# Altium project EpicCubeDiagram.PrjPCB
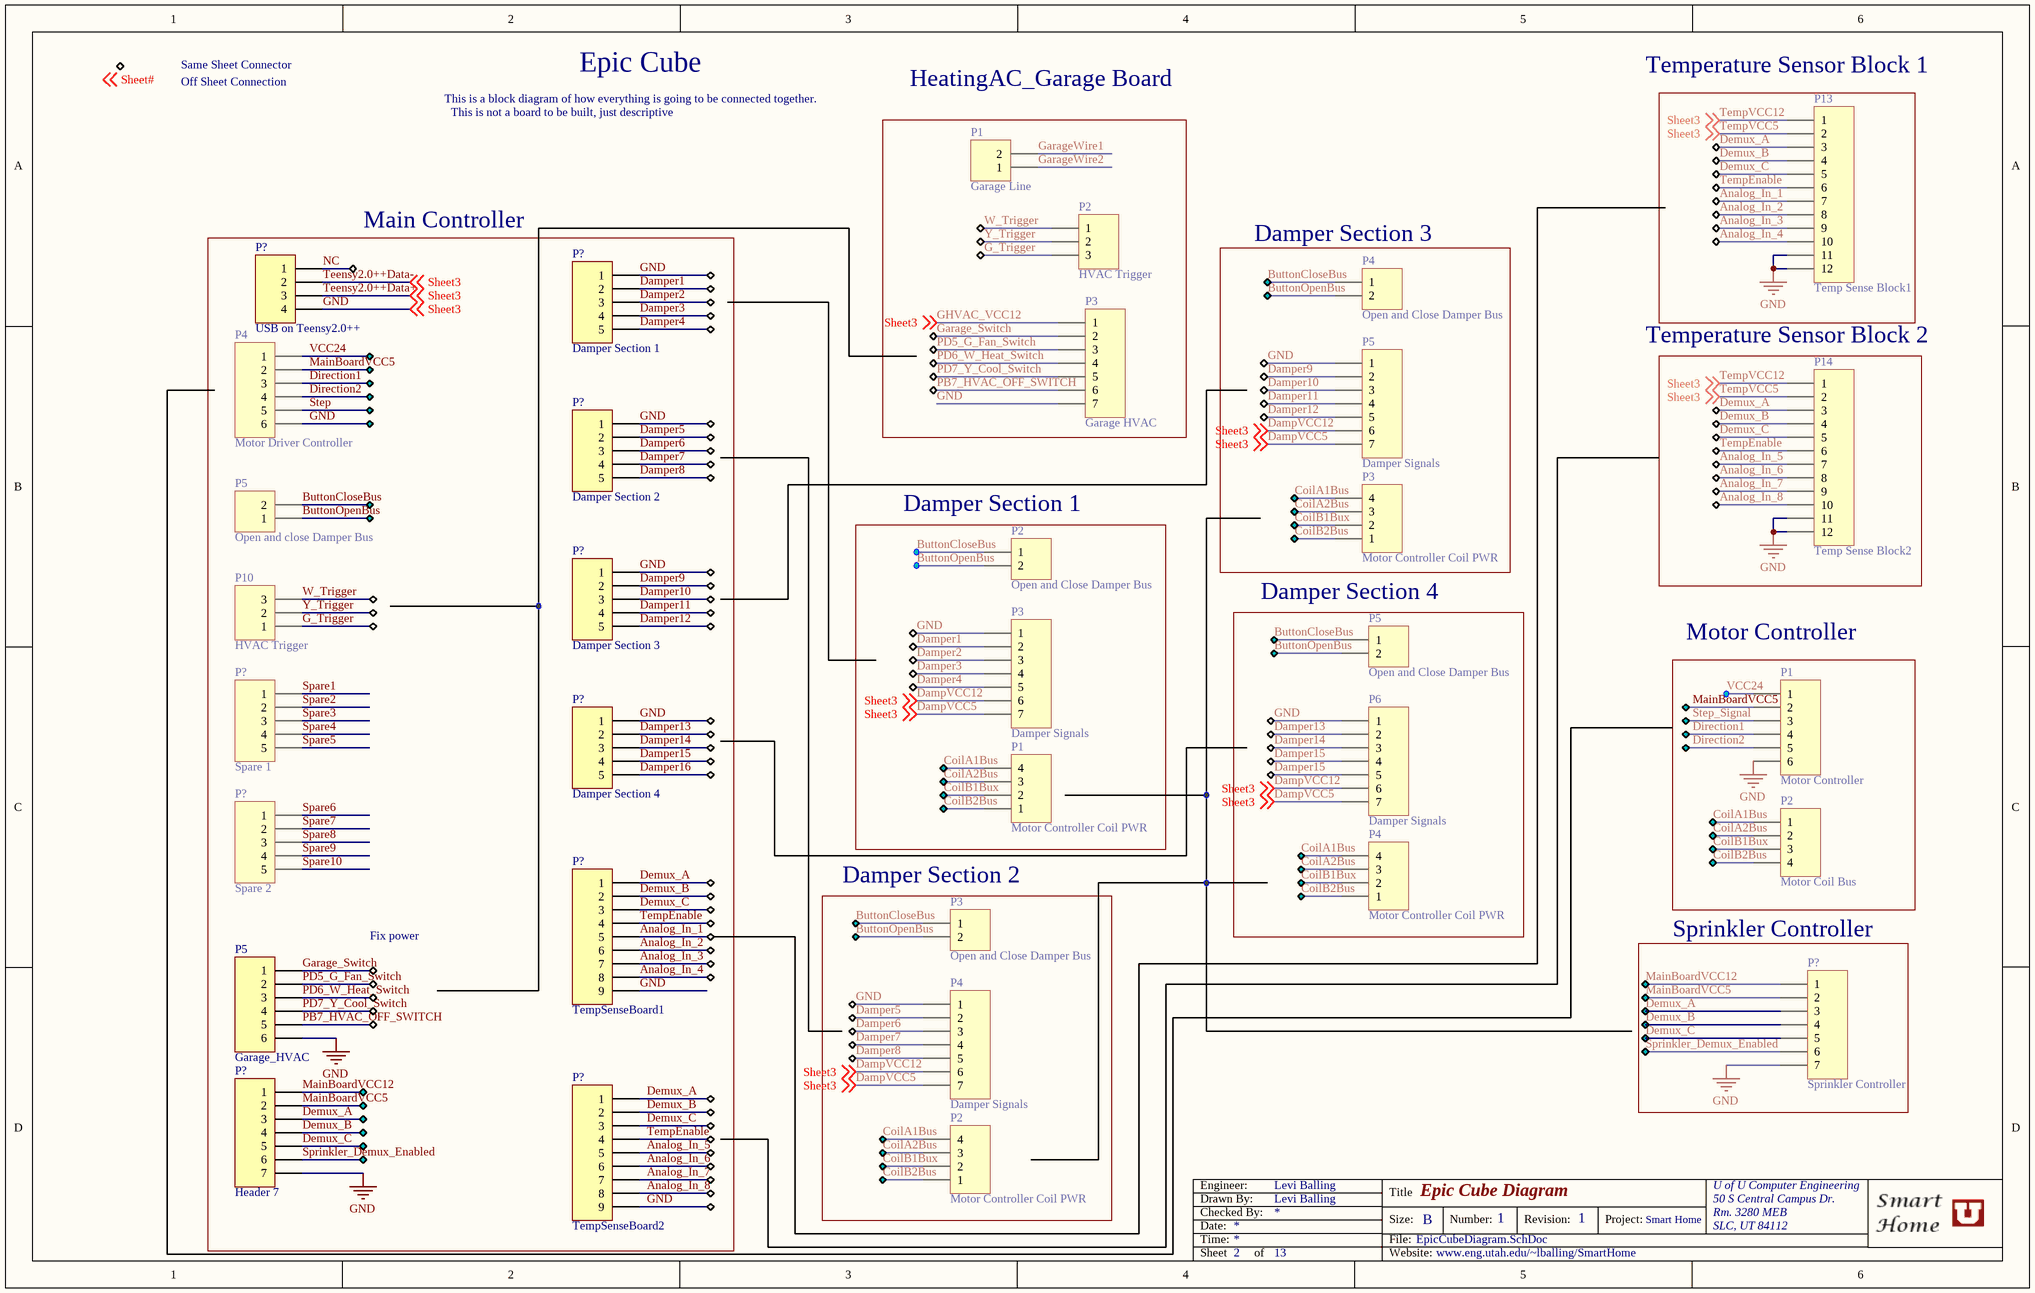
[diagram p0: EpicCubeDiagram.SchDoc]
3 sheets, 72 parts. Net scope: global (net labels, ports and power ports of the same name join across sheets).
Sheets:
  EpicCubeDiagram.SchDoc
  EpicCubeDiagram2.SchDoc
  TheEpicCube.SchDoc

## Sheet EpicCubeDiagram.SchDoc: Epic Cube Diagram
size B; CompanyName: Smart Home; DrawnBy: Levi Balling; Engineer: Levi Balling; Organization: U of U Computer Engineering; Address1: 50 S Central Campus Dr.; Address2: Rm. 3280 MEB; Address3: SLC, UT 84112; DocumentNumber: 1; Revision: 1; SheetNumber: 2; SheetTotal: 13; Project: Smart Home; Website: www.eng.utah.edu/~lballing/SmartHome

### Parts
(Parts that share a designator on the sheet are numbered #1, #2 ... from top to bottom, then left to right.)
P1#1  Garage Line  [HDR1X2]
P1#2  Motor Controller  [HDR1X6]
P1#3  Motor Controller Coil PWR  [HDR1X4]
P2#1  HVAC Trigger  [HDR1X3]
P2#2  Open and Close Damper Bus  [HDR1X2]
P2#3  Motor Coil Bus  [HDR1X4]
P2#4  Motor Controller Coil PWR  [HDR1X4]
P3#1  Garage HVAC  [HDR1X7]
P3#2  Motor Controller Coil PWR  [HDR1X4]
P3#3  Damper Signals  [HDR1X7]
P3#4  Open and Close Damper Bus  [HDR1X2]
P4#1  Open and Close Damper Bus  [HDR1X2]
P4#2  Motor Driver Controller  [HDR1X6]
P4#3  Motor Controller Coil PWR  [HDR1X4]
P4#4  Damper Signals  [HDR1X7]
P5#1  Damper Signals  [HDR1X7]
P5#2  Open and close Damper Bus  [HDR1X2]
P5#3  Open and Close Damper Bus  [HDR1X2]
P5#4  Garage_HVAC  [HDR1X6]
P6#1  Damper Signals  [HDR1X7]
P10  HVAC Trigger  [HDR1X3]
P13  Temp Sense Block1  [HDR1X12]
P14  Temp Sense Block2  [HDR1X12]
P?#1  USB on Teensy2.0++  [HDR1X4]
P?#2  Damper Section 1  [HDR1X5]
P?#3  Damper Section 2  [HDR1X5]
P?#4  Damper Section 3  [HDR1X5]
P?#5  Spare 1  [HDR1X5]
P?#6  Damper Section 4  [HDR1X5]
P?#7  Spare 2  [HDR1X5]
P?#8  TempSenseBoard1  [HDR1X9]
P?#9  Sprinkler Controller  [HDR1X7]
P?#10  Header 7  [HDR1X7]
P?#11  TempSenseBoard2  [HDR1X9]

### Blocks framed on the sheet
Main Controller: P4#2 P5#2 P5#4 P10 P?#1-P?#8 P?#10 P?#11
Damper Section 3: P3#2 P4#1 P5#1
Damper Section 1: P1#3 P2#2 P3#3
Damper Section 4: P4#3 P5#3 P6#1
Motor Controller: P1#2 P2#3
Damper Section 2: P2#4 P3#4 P4#4
Sprinkler Controller: P?#9

### Nets
DampVCC12: P1#2.6 P3#1.1 P3#1.7 P3#3.1 P3#3.6 P3#3.7 P4#2.6 P4#4.1 P4#4.6 P4#4.7 P5#1.1 P5#1.6 P5#1.7 P5#4.6 P6#1.1 P6#1.6 P6#1.7 P13.1 P13.2 P13.11 P13.12 P14.1 P14.2 P14.11 P14.12 P?#1.2 P?#1.3 P?#1.4 P?#2.1 P?#3.1 P?#4.1 P?#6.1 P?#8.9 P?#9.7 P?#10.7 P?#11.9 ; off-sheet Sheet3  [also labelled DampVCC5, GHVAC_VCC12, GND, Sheet3, Teensy2.0++Data+, Teensy2.0++Data-, TempVCC12, TempVCC5]
Analog_In_1: P13.7 P?#8.5
Analog_In_2: P13.8 P?#8.6
Analog_In_3: P13.9 P?#8.7
Analog_In_4: P13.10 P?#8.8
Analog_In_5: P14.7 P?#11.5
Analog_In_6: P14.8 P?#11.6
Analog_In_7: P14.9 P?#11.7
Analog_In_8: P14.10 P?#11.8
ButtonCloseBus: P2#2.1 P3#4.1 P4#1.1 P5#2.2 P5#3.1
ButtonOpenBus: P2#2.2 P3#4.2 P4#1.2 P5#2.1 P5#3.2
CoilA1Bus: P1#3.4 P2#3.1 P2#4.4 P3#2.4 P4#3.4
CoilA2Bus: P1#3.3 P2#3.2 P2#4.3 P3#2.3 P4#3.3
CoilB1Bux: P1#3.2 P2#3.3 P2#4.2 P3#2.2 P4#3.2
CoilB2Bus: P1#3.1 P2#3.4 P2#4.1 P3#2.1 P4#3.1
Damper1: P3#3.2 P?#2.2
Damper2: P3#3.3 P?#2.3
Damper3: P3#3.4 P?#2.4
Damper4: P3#3.5 P?#2.5
Damper5: P4#4.2 P?#3.2
Damper6: P4#4.3 P?#3.3
Damper7: P4#4.4 P?#3.4
Damper8: P4#4.5 P?#3.5
Damper9: P5#1.2 P?#4.2
Damper10: P5#1.3 P?#4.3
Damper11: P5#1.4 P?#4.4
Damper12: P5#1.5 P?#4.5
Damper13: P6#1.2 P?#6.2
Damper14: P6#1.3 P?#6.3
Damper15: P6#1.4 P6#1.5 P?#6.4
Damper16: P?#6.5
Demux_A: P13.3 P14.3 P?#8.1 P?#9.3 P?#10.3 P?#11.1
Demux_B: P13.4 P14.4 P?#8.2 P?#9.4 P?#10.4 P?#11.2
Demux_C: P13.5 P14.5 P?#8.3 P?#9.5 P?#10.5 P?#11.3
Direction1: P1#2.4 P4#2.3
Direction2: P1#2.5 P4#2.4
G_Trigger: P2#1.3 P10.1
Garage_Switch: P3#1.2 P5#4.1
GarageWire1: P1#1.2
GarageWire2: P1#1.1
MainBoardVCC5: P1#2.2 P4#2.2 P?#9.2 P?#10.2
MainBoardVCC12: P?#9.1 P?#10.1
NC: P?#1.1
PB7_HVAC_OFF_SWITCH: P3#1.6 P5#4.5
PD5_G_Fan_Switch: P3#1.3 P5#4.2
PD6_W_Heat_Switch: P3#1.4 P5#4.3
PD7_Y_Cool_Switch: P3#1.5 P5#4.4
Spare1: P?#5.1
Spare2: P?#5.2
Spare3: P?#5.3
Spare4: P?#5.4
Spare5: P?#5.5
Spare6: P?#7.1
Spare7: P?#7.2
Spare8: P?#7.3
Spare9: P?#7.4
Spare10: P?#7.5
Sprinkler_Demux_Enabled: P?#9.6 P?#10.6
Step: P4#2.5
Step_Signal: P1#2.3
TempEnable: P13.6 P14.6 P?#8.4 P?#11.4
VCC24: P1#2.1 P4#2.1
W_Trigger: P2#1.1 P10.3
Y_Trigger: P2#1.2 P10.2

### Notes on the sheet
- Same Sheet Connector
- Off Sheet Connection
- This is a block diagram of how everything is going to be connected together.
- Epic Cube
- HeatingAC_Garage Board
- (near P13) Temperature Sensor Block 1
- This is not a board to be built, just descriptive
- Temperature Sensor Block 2
- Fix power
- Labels drawn without touching a wire or pin: Sheet#
- Date:
- Time:
- Engineer:
- Drawn By:
- Checked By:
- Title
- Size:
- File:
- B
- Number:
- Revision:
- Project:
- Sheet
- of
- Website:

### Library data of the parts
P1#1 P2#2 P3#4 P4#1 P5#2 P5#3 = Header 2: Header, 2-Pin; Vendor: Taydaelectronics; LatestRevisionDate: 17-Jul-2002; LatestRevisionNote: Re-released for DXP Platform.; Publisher: Altium Limited; Price: 0.02; Value: Header 2
P1#2 P4#2 P5#4 = Header 6: Header, 6-Pin; Vendor: Taydaelectronics; LatestRevisionDate: 17-Jul-2002; LatestRevisionNote: Re-released for DXP Platform.; Publisher: Altium Limited; Price: 0.06; Value: Header 6
P1#3 P2#3 P2#4 P3#2 P4#3 P?#1 = Header 4: Header, 4-Pin; Vendor: Taydaelectronics; LatestRevisionDate: 17-Jul-2002; LatestRevisionNote: Re-released for DXP Platform.; Publisher: Altium Limited; Price: 0.04; Value: Header 4
P2#1 = Header 3: Header, 3-Pin; Vendor: Taydaelectronics; LatestRevisionDate: 17-Jul-2002; LatestRevisionNote: Re-released for DXP Platform.; Publisher: Altium Limited; Price: 0.03; Value: Header 3
P3#1 P3#3 P4#4 P5#1 P6#1 P?#9 P?#10 = Header 7: Header, 7-Pin; Vendor: Taydaelectronics; LatestRevisionDate: 17-Jul-2002; LatestRevisionNote: Re-released for DXP Platform.; Publisher: Altium Limited; Price: 0.07; Value: Header 7
P10 = Header 3: Header, 3-Pin; Vendor: Taydaelectronics; Value: Header 2; LatestRevisionDate: 17-Jul-2002; LatestRevisionNote: Re-released for DXP Platform.; Publisher: Altium Limited; Price: 0.03
P13 P14 = Header 12: Header, 12-Pin; Vendor: Taydaelectronics; LatestRevisionDate: 17-Jul-2002; LatestRevisionNote: Re-released for DXP Platform.; Publisher: Altium Limited; Price: 0.12; Value: Header 12
P?#2-P?#7 = Header 5: Header, 5-Pin; Vendor: Taydaelectronics; LatestRevisionDate: 17-Jul-2002; LatestRevisionNote: Re-released for DXP Platform.; Publisher: Altium Limited; Price: 0.05; Value: Header 5
P?#8 P?#11 = Header 9: Header, 9-Pin; Vendor: Taydaelectronics; LatestRevisionDate: 17-Jul-2002; LatestRevisionNote: Re-released for DXP Platform.; Publisher: Altium Limited; Price: 0.09; Value: Header 9

## Sheet EpicCubeDiagram2.SchDoc: Epic Cube Diagram
size B; CompanyName: Smart Home; DrawnBy: Levi Balling; Engineer: Levi Balling; Organization: U of U Computer Engineering; Address1: 50 S Central Campus Dr.; Address2: Rm. 3280 MEB; Address3: SLC, UT 84112; DocumentNumber: 1; Revision: 1; SheetNumber: 3; SheetTotal: 13; Project: Smart Home; Website: www.eng.utah.edu/~lballing/SmartHome
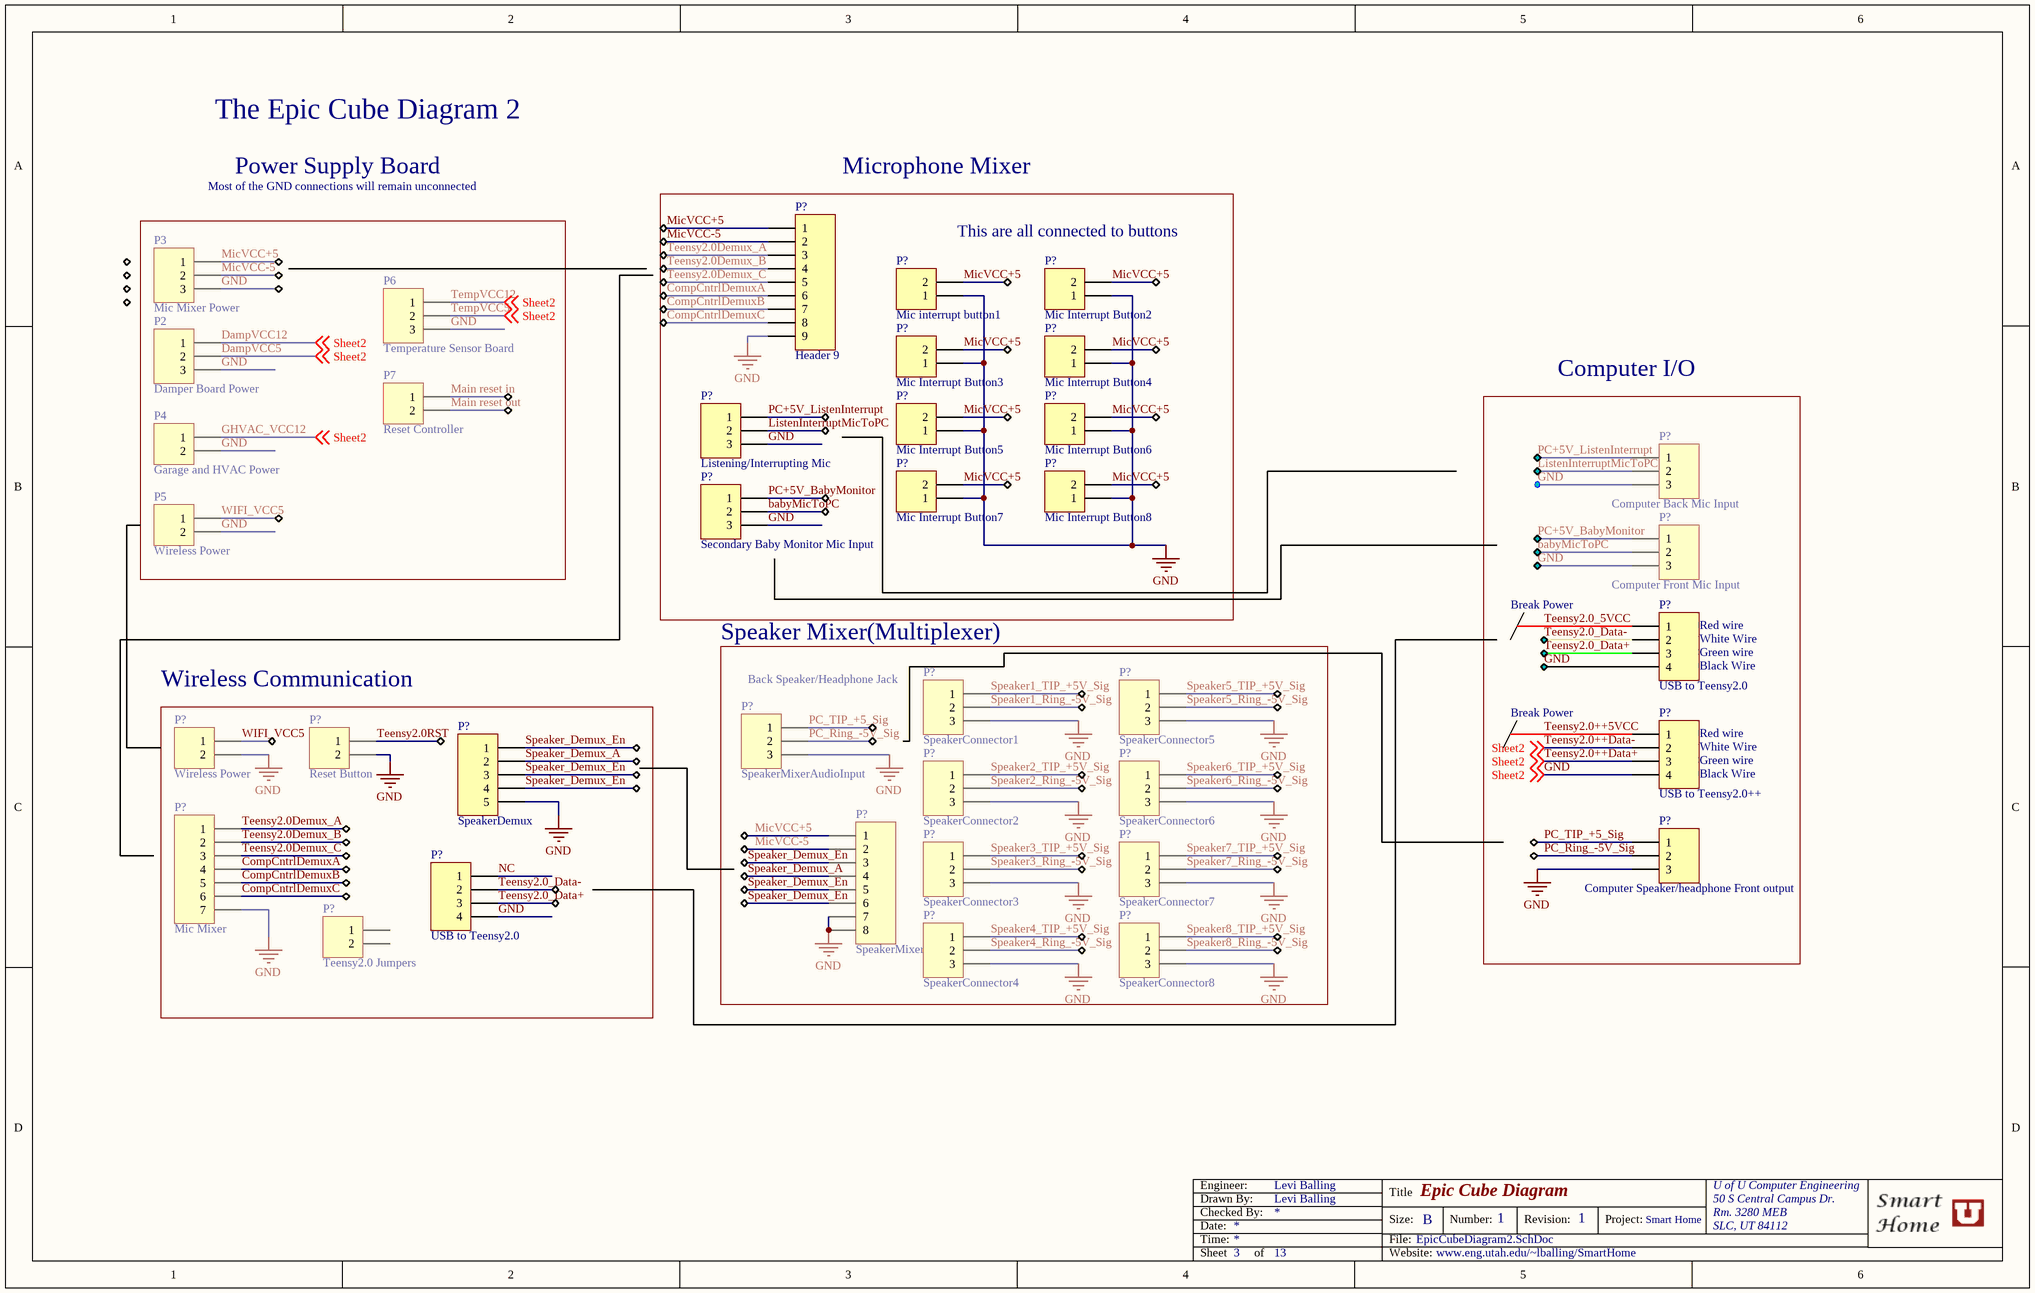
[diagram p1: EpicCubeDiagram2.SchDoc]

### Parts
(Parts that share a designator on the sheet are numbered #1, #2 ... from top to bottom, then left to right.)
P2#5  Damper Board Power  [HDR1X3]
P3#5  Mic Mixer Power  [HDR1X3]
P4#5  Garage and HVAC Power  [HDR1X2]
P5#5  Wireless Power  [HDR1X2]
P6#2  Temperature Sensor Board  [HDR1X3]
P7  Reset Controller  [HDR1X2]
P?#12  Header 9  [HDR1X9]
P?#13  Mic interrupt button1  [HDR1X2]
P?#14  Mic Interrupt Button2  [HDR1X2]
P?#15  Mic Interrupt Button3  [HDR1X2]
P?#16  Mic Interrupt Button4  [HDR1X2]
P?#17  Listening/Interrupting Mic  [HDR1X3]
P?#18  Mic Interrupt Button5  [HDR1X2]
P?#19  Mic Interrupt Button6  [HDR1X2]
P?#20  Computer Back Mic Input  [HDR1X3]
P?#21  Secondary Baby Monitor Mic Input  [HDR1X3]
P?#22  Mic Interrupt Button7  [HDR1X2]
P?#23  Mic Interrupt Button8  [HDR1X2]
P?#24  Computer Front Mic Input  [HDR1X3]
P?#25  USB to Teensy2.0  [HDR1X4]
P?#26  SpeakerConnector1  [HDR1X3]
P?#27  SpeakerConnector5  [HDR1X3]
P?#28  SpeakerMixerAudioInput  [HDR1X3]
P?#29  USB to Teensy2.0++  [HDR1X4]
P?#30  Wireless Power  [HDR1X2]
P?#31  Reset Button  [HDR1X2]
P?#32  SpeakerDemux  [HDR1X5]
P?#33  SpeakerConnector2  [HDR1X3]
P?#34  SpeakerConnector6  [HDR1X3]
P?#35  Mic Mixer  [HDR1X7]
P?#36  SpeakerMixer  [HDR1X8]
P?#37  Computer Speaker/headphone Front output  [HDR1X3]
P?#38  SpeakerConnector3  [HDR1X3]
P?#39  SpeakerConnector7  [HDR1X3]
P?#40  USB to Teensy2.0  [HDR1X4]
P?#41  Teensy2.0 Jumpers  [HDR1X2]
P?#42  SpeakerConnector4  [HDR1X3]
P?#43  SpeakerConnector8  [HDR1X3]

### Blocks framed on the sheet
Microphone Mixer: P?#12-P?#19 P?#21-P?#23
Computer I/O: P?#20 P?#24 P?#25 P?#29 P?#37
Speaker Mixer(Multiplexer): P?#26-P?#28 P?#33 P?#34 P?#36 P?#38 P?#39 P?#42 P?#43
Wireless Communication: P?#30-P?#32 P?#35 P?#40 P?#41

### Nets
DampVCC12: P2#5.1 P2#5.2 P2#5.3 P3#5.3 P4#5.1 P4#5.2 P5#5.2 P6#2.1 P6#2.2 P6#2.3 P?#12.9 P?#13.1 P?#14.1 P?#15.1 P?#16.1 P?#17.3 P?#18.1 P?#19.1 P?#20.3 P?#21.3 P?#22.1 P?#23.1 P?#24.3 P?#25.4 P?#26.3 P?#27.3 P?#28.3 P?#29.2 P?#29.3 P?#29.4 P?#30.2 P?#31.2 P?#32.5 P?#33.3 P?#34.3 P?#35.7 P?#36.7 P?#36.8 P?#37.3 P?#38.3 P?#39.3 P?#40.4 P?#42.3 P?#43.3 ; off-sheet Sheet2  [also labelled DampVCC5, GHVAC_VCC12, GND, Sheet2, Teensy2.0++Data+, Teensy2.0++Data-, TempVCC12, TempVCC5]
babyMicToPC: P?#21.2 P?#24.2
CompCntrlDemuxA: P?#12.6 P?#35.4
CompCntrlDemuxB: P?#12.7 P?#35.5
CompCntrlDemuxC: P?#12.8 P?#35.6
ListenInterruptMicToPC: P?#17.2 P?#20.2
Main reset in: P7.1
Main reset out: P7.2
MicVCC+5: P3#5.1 P?#12.1 P?#13.2 P?#14.2 P?#15.2 P?#16.2 P?#18.2 P?#19.2 P?#22.2 P?#23.2 P?#36.1
MicVCC-5: P3#5.2 P?#12.2 P?#36.2
NC: P?#40.1
PC+5V_BabyMonitor: P?#21.1 P?#24.1
PC+5V_ListenInterrupt: P?#17.1 P?#20.1
PC_Ring_-5V_Sig: P?#28.2 P?#37.2
PC_TIP_+5_Sig: P?#28.1 P?#37.1
Speaker1_Ring_-5V_Sig: P?#26.2
Speaker1_TIP_+5V_Sig: P?#26.1
Speaker2_Ring_-5V_Sig: P?#33.2
Speaker2_TIP_+5V_Sig: P?#33.1
Speaker3_Ring_-5V_Sig: P?#38.2
Speaker3_TIP_+5V_Sig: P?#38.1
Speaker4_Ring_-5V_Sig: P?#42.2
Speaker4_TIP_+5V_Sig: P?#42.1
Speaker5_Ring_-5V_Sig: P?#27.2
Speaker5_TIP_+5V_Sig: P?#27.1
Speaker6_Ring_-5V_Sig: P?#34.2
Speaker6_TIP_+5V_Sig: P?#34.1
Speaker7_Ring_-5V_Sig: P?#39.2
Speaker7_TIP_+5V_Sig: P?#39.1
Speaker8_Ring_-5V_Sig: P?#43.2
Speaker8_TIP_+5V_Sig: P?#43.1
Speaker_Demux_A: P?#32.2 P?#36.4
Speaker_Demux_En: P?#32.1 P?#32.3 P?#32.4 P?#36.3 P?#36.5 P?#36.6
Teensy2.0++5VCC: P?#29.1
Teensy2.0_5VCC: P?#25.1
Teensy2.0_Data+: P?#25.3 P?#40.3
Teensy2.0_Data-: P?#25.2 P?#40.2
Teensy2.0Demux_A: P?#12.3 P?#35.1
Teensy2.0Demux_B: P?#12.4 P?#35.2
Teensy2.0Demux_C: P?#12.5 P?#35.3
Teensy2.0RST: P?#31.1
WIFI_VCC5: P5#5.1 P?#30.1

Not connected (* = marked no-connect by the designer): P?#41 1 2

### Notes on the sheet
- The Epic Cube Diagram 2
- Most of the GND connections will remain unconnected
- Power Supply Board
- (near P?#14) This are all connected to buttons
- Break Power
- (near P?#25) Red wire
- (near P?#25) White Wire
- (near P?#28) Back Speaker/Headphone Jack
- (near P?#25) Green wire
- (near P?#25) Black Wire
- (near P?#29) Red wire
- (near P?#29) White Wire
- (near P?#29) Green wire
- (near P?#29) Black Wire
- Date:
- Time:
- Engineer:
- Drawn By:
- Checked By:
- Title
- Size:
- File:
- B
- Number:
- Revision:
- Project:
- Sheet
- of
- Website:

### Library data of the parts
P2#5 P3#5 P6#2 P?#17 P?#20 P?#21 P?#24 P?#26-P?#28 P?#33 P?#34 P?#37-P?#39 P?#42 P?#43 = Header 3: Header, 3-Pin; Vendor: Taydaelectronics; LatestRevisionDate: 17-Jul-2002; LatestRevisionNote: Re-released for DXP Platform.; Publisher: Altium Limited; Price: 0.03; Value: Header 3
P4#5 P5#5 P7 P?#13-P?#16 P?#18 P?#19 P?#22 P?#23 P?#30 P?#31 P?#41 = Header 2: Header, 2-Pin; Vendor: Taydaelectronics; LatestRevisionDate: 17-Jul-2002; LatestRevisionNote: Re-released for DXP Platform.; Publisher: Altium Limited; Price: 0.02; Value: Header 2
P?#12 = Header 9: Header, 9-Pin; Vendor: Taydaelectronics; LatestRevisionDate: 17-Jul-2002; LatestRevisionNote: Re-released for DXP Platform.; Publisher: Altium Limited; Price: 0.09; Value: Header 9
P?#25 P?#29 P?#40 = Header 4: Header, 4-Pin; Vendor: Taydaelectronics; LatestRevisionDate: 17-Jul-2002; LatestRevisionNote: Re-released for DXP Platform.; Publisher: Altium Limited; Price: 0.04; Value: Header 4
P?#32 = Header 5: Header, 5-Pin; Vendor: Taydaelectronics; LatestRevisionDate: 17-Jul-2002; LatestRevisionNote: Re-released for DXP Platform.; Publisher: Altium Limited; Price: 0.05; Value: Header 5
P?#35 = Header 7: Header, 7-Pin; Vendor: Taydaelectronics; LatestRevisionDate: 17-Jul-2002; LatestRevisionNote: Re-released for DXP Platform.; Publisher: Altium Limited; Price: 0.07; Value: Header 7
P?#36 = Header 8: Header, 8-Pin; Vendor: Taydaelectronics; LatestRevisionDate: 17-Jul-2002; LatestRevisionNote: Re-released for DXP Platform.; Publisher: Altium Limited; Price: 0.08; Value: Header 8

## Sheet TheEpicCube.SchDoc: The Epic Cube
size B; CompanyName: Smart Home; DrawnBy: Levi Balling; Engineer: Levi Balling; Organization: U of U Computer Engineering; Address1: 50 S. Central Campus Dr.; Address2: Rm. 3280 MEB; Address3: Salt Lake City, UT; Address4: Australia 2086; DocumentNumber: 1; Revision: 1; SheetNumber: 1; SheetTotal: 13; Website: www.eng.utah.edu/~lballing/SmartHome; Project: Smart Home; DocumentName: Title Page; ProjectName: Smart Home
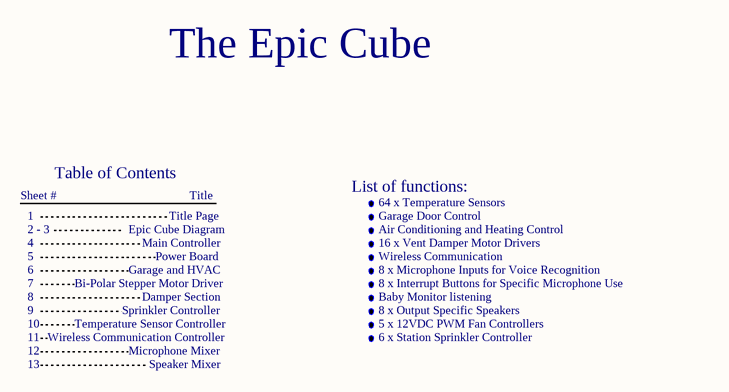
[diagram p2: TheEpicCube.SchDoc]

### Notes on the sheet
- The Epic Cube
- Sheet #
- 1
- Table of Contents
- Title Page
- Title
- List of functions:
- 64 x Temperature Sensors
- Garage Door Control
- 2 - 3
- 4
- 5
- 6
- 7
- Bi-Polar Stepper Motor Driver
- Epic Cube Diagram
- Garage and HVAC
- Main Controller
- Power Board
- Air Conditioning and Heating Control
- 16 x Vent Damper Motor Drivers
- Wireless Communication
- 8 x Microphone Inputs for Voice Recognition
- 8 x Interrupt Buttons for Specific Microphone Use
- 8
- 9
- 10
- 11
- 12
- Wireless Communication Controller
- Temperature Sensor Controller
- Sprinkler Controller
- Microphone Mixer
- Damper Section
- Baby Monitor listening
- 8 x Output Specific Speakers
- 5 x 12VDC PWM Fan Controllers
- 6 x Station Sprinkler Controller
- 13
- Speaker Mixer
- Date:
- Time:
- Engineer:
- Drawn By:
- Checked By:
- Size:
- File:
- B
- Number:
- Revision:
- Project:
- Sheet
- of
- Website:

## Nets that join several sheets
DampVCC12: EpicCubeDiagram (36 pins), EpicCubeDiagram2 (44 pins)
NC: EpicCubeDiagram (P?#1.1), EpicCubeDiagram2 (P?#40.1)